# EAGLE design aircopter (EAGLE 9.7.0)
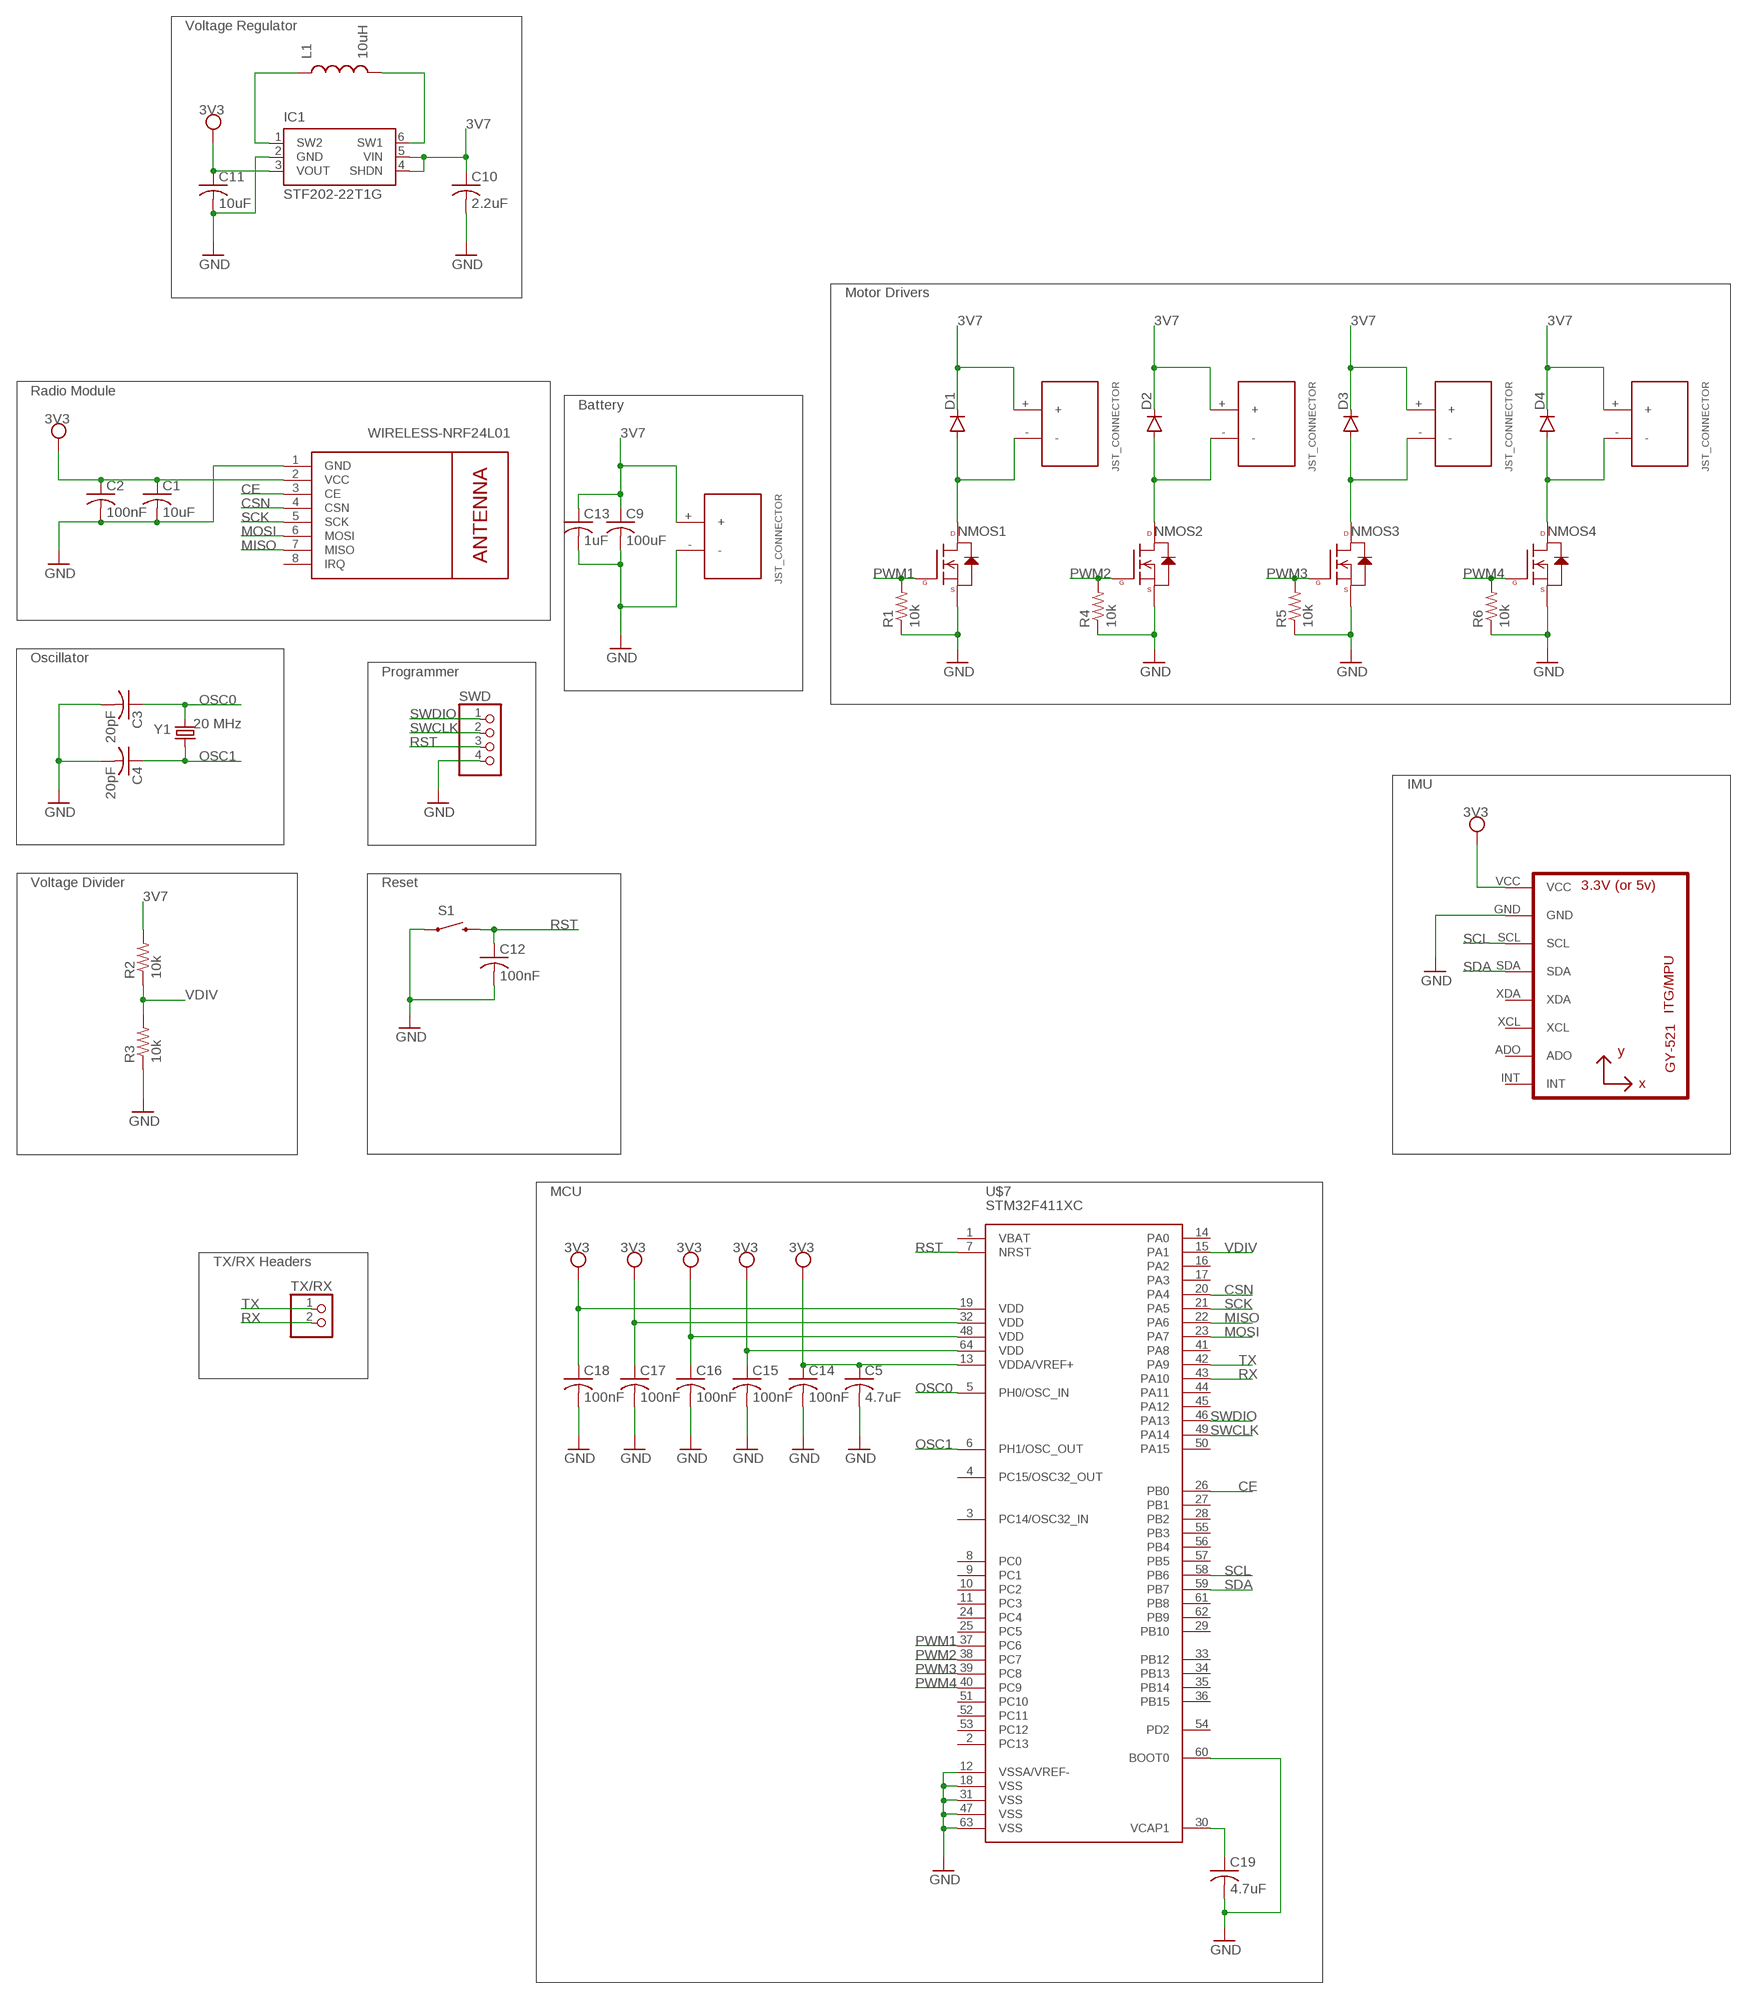
[diagram p0: schematic, sheet 1]

## Parts
C1  10uF  C-USC0603  [C0603]
C2  100nF  C-USC0603  [C0603]
C3  20pF  C-USC0603  [C0603]
C4  20pF  C-USC0603  [C0603]
C5  4.7uF  C-USC0603  [C0603]
C9  100uF  C-USC0603  [C0603]
C10  2.2uF  C-USC0603  [C0603]
C11  10uF  C-USC0603  [C0603]
C12  100nF  C-USC0603  [C0603]
C13  1uF  C-USC0603  [C0603]
C14  100nF  C-USC0603  [C0603]
C15  100nF  C-USC0603  [C0603]
C16  100nF  C-USC0603  [C0603]
C17  100nF  C-USC0603  [C0603]
C18  100nF  C-USC0603  [C0603]
C19  4.7uF  C-USC0603  [C0603]
D1  DIODESMA  [SMA-DIODE]
D2  DIODESMA  [SMA-DIODE]
D3  DIODESMA  [SMA-DIODE]
D4  DIODESMA  [SMA-DIODE]
IC1  STF202-22T1G  [SOT23-6]
L1  10uH  INDUCTOR  [L0603]
M1  WIRELESS-NRF24L01  [WIRELESS-NRF24L01]
NMOS1  N-CHANNEL-MOSFET-BSS138  [SOT23-3]
NMOS2  N-CHANNEL-MOSFET-BSS138  [SOT23-3]
NMOS3  N-CHANNEL-MOSFET-BSS138  [SOT23-3]
NMOS4  N-CHANNEL-MOSFET-BSS138  [SOT23-3]
R1  10k  R-US_R0603  [R0603]
R2  10k  R-US_R0603  [R0603]
R3  10k  R-US_R0603  [R0603]
R4  10k  R-US_R0603  [R0603]
R5  10k  R-US_R0603  [R0603]
R6  10k  R-US_R0603  [R0603]
S1  SWITCH-MOMENTARY-2SMD  [TACTILE-SWITCH-SMD]
SWD  PINHD-1X4  [1X04]
TX/RX  PINHD-1X2  [1X02]
U2  GY-521MPU6050  [GY-521]
U$2  JST_CONNECTOR_FEMALE  [JST_CONNECTOR_FEMALE]
U$3  JST_CONNECTOR_FEMALE  [JST_CONNECTOR_FEMALE]
U$4  JST_CONNECTOR_FEMALE  [JST_CONNECTOR_FEMALE]
U$5  JST_CONNECTOR_FEMALE  [JST_CONNECTOR_FEMALE]
U$6  JST_CONNECTOR_FEMALE  [JST_CONNECTOR_FEMALE]
U$7  STM32F411XC  [LQFP64]
Y1  20 MHz  CRYSTALSMD  [HC49UP]

## Nets
3V3: C1.1 C2.1 C5.1 C11.1 C14.1 C15.1 C16.1 C17.1 C18.1 IC1.3(VOUT) M1.2(VCC) U2.VCC U$7.13(VDDA/VREF+) U$7.19(VDD) U$7.32(VDD) U$7.48(VDD) U$7.64(VDD) ; supply symbol labelled 3V3-CIRCLE
3V7: C9.1 C10.1 C13.1 D1.C D2.C D3.C D4.C IC1.4(SHDN) IC1.5(VIN) R2.2 U$2.+ U$3.+ U$4.+ U$5.+ U$6.+
CE: M1.3(CE) U$7.26(PB0)
CSN: M1.4(CSN) U$7.20(PA4)
GND: C1.2 C2.2 C3.2 C4.2 C5.2 C9.2 C10.2 C11.2 C12.2 C13.2 C14.2 C15.2 C16.2 C17.2 C18.2 C19.2 IC1.2(GND) M1.1(GND) NMOS1.2(S) NMOS2.2(S) NMOS3.2(S) NMOS4.2(S) R1.1 R3.1 R4.1 R5.1 R6.1 S1.1 SWD.4 U2.GND U$6.- U$7.12(VSSA/VREF-) U$7.18(VSS) U$7.31(VSS) U$7.47(VSS) U$7.60(BOOT0) U$7.63(VSS) ; supply symbol labelled SUPPLY1_GND
MISO: M1.7(MISO) U$7.22(PA6)
MOSI: M1.6(MOSI) U$7.23(PA7)
N$1: D1.A NMOS1.3(D) U$2.-
N$2: D2.A NMOS2.3(D) U$3.-
N$3: D3.A NMOS3.3(D) U$4.-
N$4: D4.A NMOS4.3(D) U$5.-
N$5: IC1.1(SW2) L1.1
N$6: IC1.6(SW1) L1.2
N$7: C19.1 U$7.30(VCAP1)
OSC0: C3.1 U$7.5(PH0/OSC_IN) Y1.2
OSC1: C4.1 U$7.6(PH1/OSC_OUT) Y1.1
PWM1: NMOS1.1(G) R1.2 U$7.37(PC6)
PWM2: NMOS2.1(G) R4.2 U$7.38(PC7)
PWM3: NMOS3.1(G) R5.2 U$7.39(PC8)
PWM4: NMOS4.1(G) R6.2 U$7.40(PC9)
RST: C12.1 S1.3 SWD.3 U$7.7(NRST)
RX: TX/RX.2 U$7.43(PA10)
SCK: M1.5(SCK) U$7.21(PA5)
SCL: U2.SCL U$7.58(PB6)
SDA: U2.SDA U$7.59(PB7)
SWCLK: SWD.2 U$7.49(PA14)
SWDIO: SWD.1 U$7.46(PA13)
TX: TX/RX.1 U$7.42(PA9)
VDIV: R2.1 R3.2 U$7.15(PA1)
Unconnected: M1.8(IRQ) U2.ADO U2.INT U2.XCL U2.XDA U$7.1(VBAT) U$7.2(PC13) U$7.3(PC14/OSC32_IN) U$7.4(PC15/OSC32_OUT) U$7.8(PC0) U$7.9(PC1) U$7.10(PC2) U$7.11(PC3) U$7.14(PA0) U$7.16(PA2) U$7.17(PA3) U$7.24(PC4) U$7.25(PC5) U$7.27(PB1) U$7.28(PB2) U$7.29(PB10) U$7.33(PB12) U$7.34(PB13) U$7.35(PB14) U$7.36(PB15) U$7.41(PA8) U$7.44(PA11) U$7.45(PA12) U$7.50(PA15) U$7.51(PC10) U$7.52(PC11) U$7.53(PC12) U$7.54(PD2) U$7.55(PB3) U$7.56(PB4) U$7.57(PB5) U$7.61(PB8) U$7.62(PB9)

## Notes on the sheet
- Voltage Regulator
- Motor Drivers
- Radio Module
- Battery
- Oscillator
- Programmer
- IMU
- Voltage Divider | Reset
- MCU
- TX/RX Headers

## Library data of the parts
C1-C5 C9-C19 = rcl:C-US: CAPACITOR, American symbol; SPICEPREFIX: C
D1-D4 = BeagleBone_Blue_R3:DIODE: Diode These are standard reverse protection diodes and small signal diodes. SMA package can handle up to about 1A. SOD-323 can handle about 200mA. What the SOD-323 package when ordering, there are some mfgs out there that are 5-pin packages.
IC1 = stf202_10:STF202-22T1G: USB Filter with ESD Protection Source: http://www.onsemi.com/pub_link/Collateral/STF202-22T1-D.PDF; MF: ON Semiconductor; MPN: STF202-22T1G; OC_FARNELL: 1651958; OC_NEWARK: 45J2271
L1 = BeagleBone_Blue_R3:INDUCTOR: Inductors Basic Inductor/Choke - 0603 and 1206. Footprints are not proven and vary greatly between part numbers. SRN6045- 33uH, 20% 1.4A
M1 = AP_quad:WIRELESS-NRF24L01: 2.4 GHz Wireless Module based on NRF24L01 chip
NMOS1-NMOS4 = AP_quad:N-CHANNEL-MOSFET: N-Channel MOSFET Mode Field Effect Transistor; DATASHEET: http://www.fairchildsemi.com/ds/BS/BSS138.pdf; DIGIKEY: BSS138TR-ND; ELEMENT14: 2323154; URL: http://au.element14.com/fairchild-semiconductor/bss138/mosfet-n-ch-50v-220ma-sot-23/dp/2323154
R1-R6 = rcl:R-US_: RESISTOR, American symbol; SPICEPREFIX: R
S1 = AP_quad:SWITCH-MOMENTARY-2: Various NO switches- pushbuttons, reed, etc; PROD_ID: SWCH-08247
SWD = pinhead:PINHD-1X4: PIN HEADER
TX/RX = pinhead:PINHD-1X2: PIN HEADER
U2 = Aircopter_quad_lib:GY-521
U$2-U$6 = Aircopter_quad_lib:JST_CONNECTOR_FEMALE
U$7 = Aircopter_quad_lib:STM32F411XC: STM32F411XC
Y1 = Aircopter_quad_lib:CRYSTAL: Crystals Various standard crystals. Proven footprints. Spark Fun Electronics SKU : COM-00534

## Board
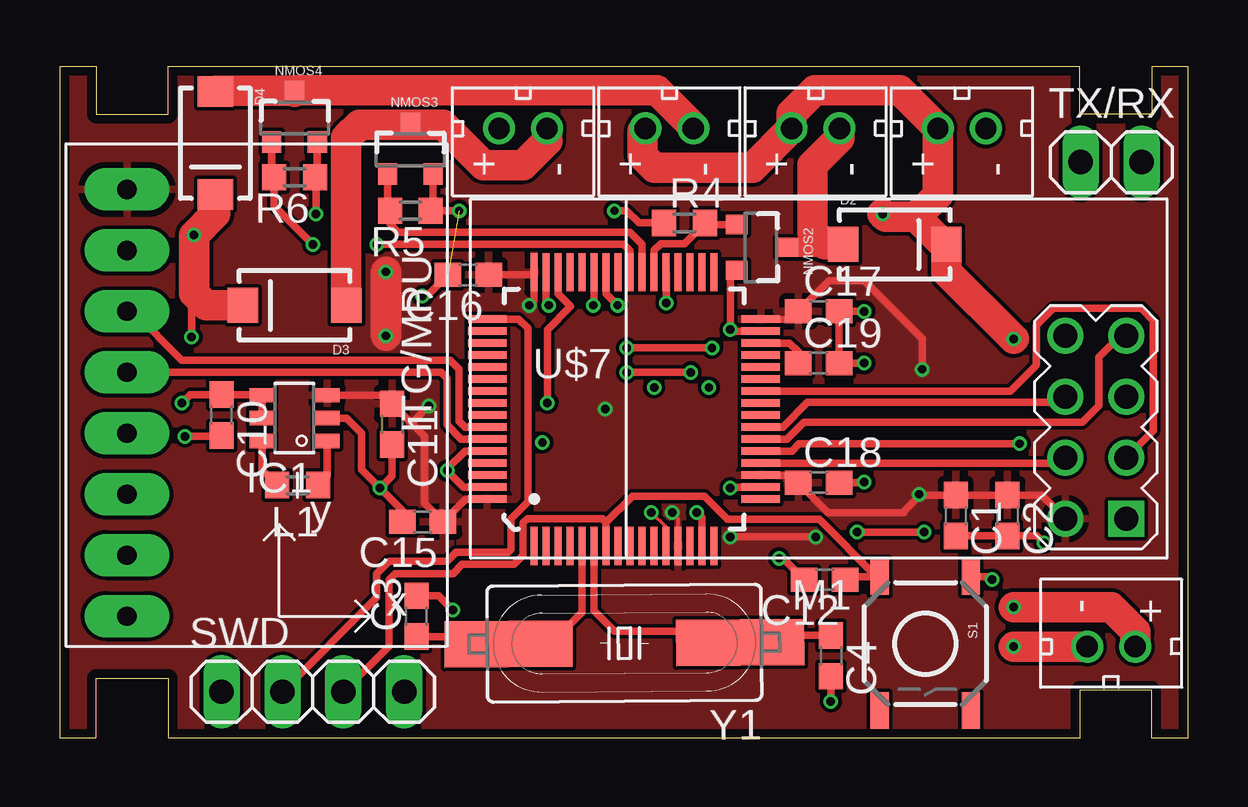
[diagram p1: board, top side]
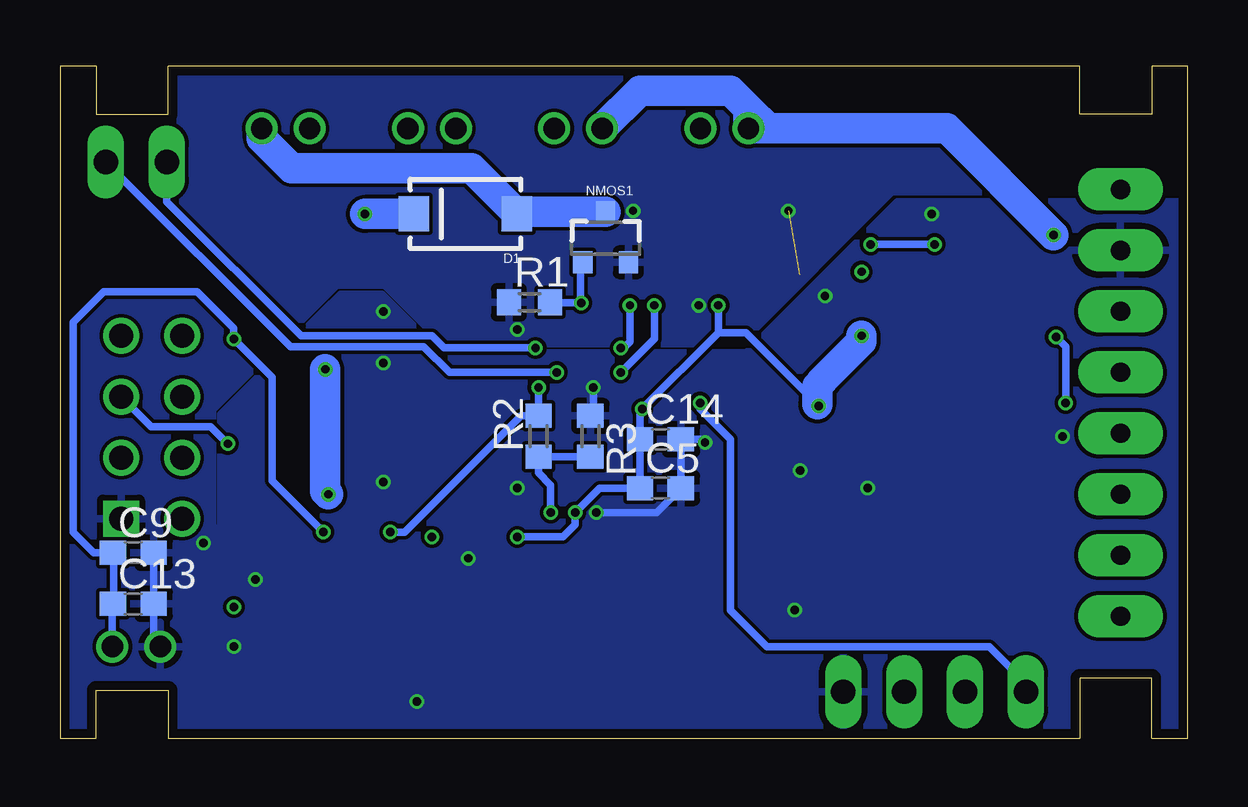
[diagram p2: board, bottom side, seen from below]

Size 47 x 28 mm. Coordinates in mm from the lower left corner, seen from the top.
Outline: 0,0 0,28 1.5,28 1.5,26 4.5,26 4.5,28 42.5,28 42.5,26 45.5,26 45.5,28 47,28 47,0 45.5,0 45.5,2 42.5,2 42.5,0 4.5,0 4.5,2.5 1.5,2.5 1.5,0 0,0
Copper layers (1*16): Top 0.035559375mm / dielectric 1.6mm / Bottom 0.035559375mm
Design rules "oshpark-2layer": minimum track width 6mil, minimum drill 10mil, track to track 6mil, track to pad 6mil, pad to pad 6mil, via to via 6mil, smd to smd 6mil, copper to edge 15mil, drill to drill 6mil, minimum pad ring 5mil, minimum via ring 5mil, stop-mask expansion 2.5mil, vias tented up to drill 0mil, thermal gap 10mil

### Footprints (pad centres in the part's own frame; a part is rotated, then mirrored left to right if it is on the bottom)
C0603 = smd 1.1 x 1: 1 -0.85,0; 2 0.85,0
SMA-DIODE = smd 1.27 x 1.47: A -2.15,0; C 2.15,0
SOT23-6 = smd 0.6 x 1.05: 1 -0.95,-1.35; 2 0,-1.35; 3 0.95,-1.35; 4 0.95,1.35; 5 0,1.35; 6 -0.95,1.35
L0603 = smd 1 x 1.1: 1 -0.85,0; 2 0.85,0
WIRELESS-NRF24L01 = drill 1 square: 1 -12.7,6.35 | drill 1: 2 -10.16,6.35; 3 -12.7,3.81; 4 -10.16,3.81; 5 -12.7,1.27; 6 -10.16,1.27; 7 -12.7,-1.27; 8 -10.16,-1.27
SOT23-3 = smd 0.8 x 0.9: 1 -0.95,-1; 2 0.95,-1; 3 0,1.1
R0603 = smd 1 x 1.1: 1 -0.85,0; 2 0.85,0
TACTILE-SWITCH-SMD = smd 1.524 x 0.762: 1 -2.794,1.905; 2 2.794,1.905; 3 -2.794,-1.905; 4 2.794,-1.905
1X04 = drill 1.016 long: 1 -3.81,0; 2 -1.27,0; 3 1.27,0; 4 3.81,0
1X02 = drill 1.016 long: 1 -1.27,0; 2 1.27,0
GY-521 = drill 0.8 pad 1.778 long: ADO -8.89,-6.35; GND -8.89,6.35; INT -8.89,-8.89; SCL -8.89,3.81; SDA -8.89,1.27; VCC -8.89,8.89; XCL -8.89,-3.81; XDA -8.89,-1.27
JST_CONNECTOR_FEMALE = drill 0.889: + 0,1; - 0,-1
LQFP64 = smd 0.3 x 1.6: 1 -3.75,-5.7; 2 -3.25,-5.7; 3 -2.75,-5.7; 4 -2.25,-5.7; 5 -1.75,-5.7; 6 -1.25,-5.7; 7 -0.75,-5.7; 8 -0.25,-5.7; 9 0.25,-5.7; 10 0.75,-5.7; 11 1.25,-5.7; 12 1.75,-5.7; 13 2.25,-5.7; 14 2.75,-5.7; 15 3.25,-5.7; 16 3.75,-5.7; 33 3.75,5.7; 34 3.25,5.7; 35 2.75,5.7; 36 2.25,5.7; 37 1.75,5.7; 38 1.25,5.7; 39 0.75,5.7; 40 0.25,5.7; 41 -0.25,5.7; 42 -0.75,5.7; 43 -1.25,5.7; 44 -1.75,5.7; 45 -2.25,5.7; 46 -2.75,5.7; 47 -3.25,5.7; 48 -3.75,5.7 | smd 1.6 x 0.3: 17 5.7,-3.75; 18 5.7,-3.25; 19 5.7,-2.75; 20 5.7,-2.25; 21 5.7,-1.75; 22 5.7,-1.25; 23 5.7,-0.75; 24 5.7,-0.25; 25 5.7,0.25; 26 5.7,0.75; 27 5.7,1.25; 28 5.7,1.75; 29 5.7,2.25; 30 5.7,2.75; 31 5.7,3.25; 32 5.7,3.75; 49 -5.7,3.75; 50 -5.7,3.25; 51 -5.7,2.75; 52 -5.7,2.25; 53 -5.7,1.75; 54 -5.7,1.25; 55 -5.7,0.75; 56 -5.7,0.25; 57 -5.7,-0.25; 58 -5.7,-0.75; 59 -5.7,-1.25; 60 -5.7,-1.75; 61 -5.7,-2.25; 62 -5.7,-2.75; 63 -5.7,-3.25; 64 -5.7,-3.75
HC49UP = smd 5.334 x 1.93: 1 -4.826,0; 2 4.826,0

### Placement (x,y rotation side)
C1  37.34,9.27 270 top
C2  39.5,9.27 270 top
C3  14.86,5.08 90 top
C4  32.13,3.43 270 top
C5  21.97,10.41 0 bottom
C9  43.94,7.72 0 bottom
C10  6.73,13.46 270 top
C11  13.84,13.08 270 top
C12  31.88,6.6 180 top
C13  43.94,5.59 0 bottom
C14  21.97,12.45 0 bottom
C15  15.11,9.02 180 top
C16  17.02,19.3 180 top
C17  31.62,17.78 0 top
C18  31.62,10.64 0 top
C19  31.62,15.62 0 top
D1  30.1,21.84 180 bottom
D2  34.8,20.57 0 top
D3  9.78,18.03 180 top
D4  6.48,24.79 270 top
IC1  9.78,13.34 90 top
L1  9.91,10.54 180 top
M1  31.75,15.49 180 top
NMOS1  24.26,20.83 0 bottom
NMOS2  29.21,20.45 270 top
NMOS3  14.61,24.51 0 top
NMOS4  9.78,25.83 0 top
R1  27.43,18.16 0 bottom
R2  27.05,12.57 90 bottom
R3  24.89,12.57 270 bottom
R4  26.04,21.46 0 top
R5  14.61,21.97 180 top
R6  9.78,23.37 180 top
S1  36.07,3.94 270 top
SWD  10.54,1.93 0 top
TX/RX  43.81,24 0 top
U2  11.68,13.97 0 top
U$2  37.59,25.4 90 top
U$3  31.5,25.4 90 top
U$4  19.3,25.4 90 top
U$5  25.4,25.4 90 top
U$6  43.81,3.81 270 top
U$7  23.51,13.71 0 top
Y1  23.52,3.95 180.4 top

### Tracks (layer width: path | path; a pad name or v marks a point on that pad's centre or on a via)
3V3  (via drill 0.35)
  Top 0.152: U$7.13 25.76,9.16 v25.53,9.4 | 30.69,17.7 C17.1 | C18.1 30.77,10.69 30.51,10.96
  Top 0.305: U$7.64 16.91,9.96 C15.1 15.2,9.78 15.2,12.57 14.59,13.19 | C16.1 19.66,19.3 U$7.48 19.76,18.24 v19.56,18.03 | IC1.3 13.49,14.29 C11.1 14.59,13.19 | 14.59,13.19 14.71,13.19 v15.37,13.84 | v27.94,8.38 v31.5,8.38 | U$7.32 30.45,17.46 30.69,17.7 | C17.1 32.04,19.05 33.53,19.05 35.94,16.64 v35.94,15.37 | M1.2 40.93,10.12 C2.1 C1.1 35.85,10.12 | 35.85,10.12 v35.81,10.16 | U$7.19 30.51,10.96 | 35.85,10.12 35.18,9.45 35.18,9.4 32.02,9.4 C18.1
  Top 1.27: v13.59,19.43 v13.59,16.76
  Bottom 0.305: v19.56,18.03 19.56,16.89 | 19.56,16.89 v22.73,13.72 22.82,13.63 C14.1 C5.1 24.51,10.41 v25.53,9.4 25.53,8.89 26.04,8.38 v27.94,8.38 | v15.37,13.84 15.43,13.91 18.41,16.89 19.56,16.89
  Bottom 1.27: v13.59,16.76 13.59,16.53 15.24,14.88 15.22,14.88 15.43,14.67 15.43,13.91 | v35.94,15.37 35.94,10.29 v35.81,10.16
  pour Top: -0.36,-0.58 47.6,-0.58 47.62,-0.61 47.62,28.42 47.65,28.45 -0.38,28.32
3V7  (via drill 0.35)
  Top 0.305: IC1.5 IC1.4 8.4,14.31 C10.1 5.42,14.31 v5.08,13.97 | 5.59,18.54 5.49,18.44 v5.49,16.71 | v33.22,8.59 v36.02,8.59
  Top 1.27: D4.C 6.48,21.84 v5.59,20.95 5.59,18.54 6.1,18.03 D3.C | U$6.+ 44.81,4.43 44.83,4.45 43.81,5.46 v39.75,5.46 | 35.69,21.72 36.83,20.57 D2.C 36.95,19.44 v39.75,16.64 | 35.69,21.72 34.42,21.72 v34.29,21.84 | 35.69,21.72 36.59,22.62 U$2.+ 35.01,26.98 31.47,26.98 30.5,26.01 U$3.+ 28.85,23.76 24.79,23.76 24.28,24.27 24.28,25.28 U$5.+
  Bottom 0.305: U$6.+ 44.81,5.57 C13.1 44.77,5.61 44.77,7.7 C9.1 45.59,7.72 46.46,8.59 46.46,17.32 45.19,18.59 41.27,18.59 39.75,17.07 v39.75,16.64 38.15,15.04 38.15,10.72 v36.02,8.59 | v27.05,14.61 R2.2 27.79,13.42 32.62,8.59 v33.22,8.59 | v5.08,13.97 5.08,16.31 v5.49,16.71
  Bottom 1.27: D1.C v34.29,21.84 | U$5.+ 22.82,26.98 19.05,26.98 18.3,26.23 | 18.3,26.23 U$4.+ 17.48,25.4 | 17.48,25.4 10.03,25.4 v5.59,20.95 | 17.48,25.4 18.3,26.23
CE
  Top 0.305: M1.3 45.58,12.81 45.58,17.4 45.07,17.91 41.4,17.91 40.69,17.2 40.69,15.54 39.61,14.46 U$7.26
CSN
  Top 0.305: M1.4 41.69,11.46 U$7.20
GND  (via drill 0.35)  (1 unrouted)
  Top 0.152: 32.73,10.39 C18.2 | C19.2 | 17.83,11.94 U$7.60 | 28,16.96 v27.94,17.02 | 27.99,10.46 v27.94,10.41 | U$7.12 25.26,8.8 24.66,9.4 v24.64,9.4
  Top 0.305: v16.38,5.33 15.79,5.93 C3.2 | v32.13,1.52 C4.2 | v38.86,6.6 38.73,6.73 S1.1 | C1.2 C2.2 40.73,8.42 v41.02,8.13 | v33.53,10.67 33.5,10.64 C18.2 | U$7.18 27.99,10.46 | C12.2 30.14,7.49 v29.97,7.49 | v33.53,17.78 C17.2 C19.2 v33.53,15.62 | 15.62,23.45 NMOS3.2 15.55,22.07 R5.1 v16.64,21.97 | 10.79,24.77 NMOS4.2 10.73,23.47 R6.1 10.67,23.33 v10.67,21.84 | C16.2 15.28,18.41 v15.11,18.41 | U$7.47 20.26,18.14 v20.37,18.03 | v23.11,21.97 23.62,21.97 24.13,21.46 R4.1 | v27.94,17.02 27.94,19.23 NMOS2.2 | IC1.2 11.94,13.34 12.57,12.7 12.57,11.18 v13.34,10.41 | C10.2 6.69,12.57 v5.21,12.57 | C11.2 13.84,10.92 v13.34,10.41 | v13.34,10.41 14.26,9.49 C15.2 | U$7.60 16.88,11.96 16.14,11.22 v16.14,11.14 16.82,10.46 U$7.63 | U$7.31 28,16.96
  Top 1.27: U$6.- v39.75,3.81
  Bottom 0.305: C9.2 C13.2 43.09,4.09 U$6.- | v24.64,9.4 22.14,9.4 C5.2 C14.2 20.24,12.45 v20.11,12.32 | R3.1 24.77,13.55 v24.77,14.61
  pour Bottom: -0.43,22.78 -0.46,22.76 12.32,22.76 18.64,16.43 31.04,16.43 33.48,18.87 35.46,18.87 40.64,13.69 40.64,-1.04 40.61,-1.07 47.65,-1.07 47.68,-1.04 47.68,28.5 -0.43,28.5
  pour Bottom: 12.09,22.35 18.39,16.05 18.82,16.05 31.14,16.05 33.58,18.49 33.76,18.49 35.31,18.49 36.04,17.75 40.31,13.49 40.31,9.02 40.31,8.74 47.62,8.74 47.65,8.76 47.65,-0.61 -0.36,-0.61 -0.38,-0.64 -0.38,22.35
MISO
  Top 0.305: U$7.22 30.3,12.46 31,13.16 42.62,13.16 43.31,13.84 43.31,15.88 44.2,16.76 M1.7
MOSI
  Top 0.305: U$7.23 30.13,12.96 31.16,13.99 41.17,13.99 41.4,14.22 M1.6
N$1
  Bottom 1.27: NMOS1.3 27.86,21.93 D1.A 29.85,23.75 37.34,23.75 38.59,25 U$2.-
N$2
  Top 0.813: NMOS2.3 31.75,20.45 31.88,20.57
  Top 1.27: D2.A 31.88,20.57 31.37,21.08 31.37,23.88 32.5,25 U$3.-
N$3
  Top 0.305: 14.66,25.56 NMOS3.3 14.55,25.56
  Top 1.27: 14.66,25.56 15.97,25.56 17.65,23.88 19.3,23.88 20.32,24.89 20.3,24.91 U$4.- | 14.55,25.56 12.48,25.56 11.93,25.01 11.93,19.3 D3.A
N$4
  Top 1.27: U$5.- 26.4,25.47 24.89,26.98 9.78,26.98 NMOS4.3 9.74,26.97 6.5,26.97 D4.A
N$5
  Top 0.305: IC1.1 11.13,10.91 L1.1
N$6
  Top 0.305: IC1.6 8.43,11.17 L1.2
N$7
  Top 0.305: U$7.30 30.4,16.46 30.77,16.09 C19.1
OSC0
  Top 0.305: U$7.5 21.76,5.25 20.43,3.92 Y1.2 18.38,4.23 16.1,4.23 C3.1
OSC1
  Top 0.305: U$7.6 22.26,5.3 23.11,4.45 26.52,4.45 26.64,4.57 27.76,4.57 Y1.1 28.64,4.28 C4.1
PWM1  (via drill 0.35)
  Top 0.305: U$7.37 25.27,19.4 v25.27,18.14
  Bottom 0.305: R1.2 26.56,18.14 v25.27,18.14 25.3,18.16 25.3,19.74 NMOS1.1
PWM2
  Top 0.305: NMOS2.1 26.95,21.4 R4.2 26.02,20.6 25.04,20.6 24.76,20.32 U$7.38
PWM3
  Top 0.305: U$7.39 24.26,20.57 23.75,21.08 14.1,21.08 13.76,21.42 R5.2 13.65,22.07 NMOS3.1
PWM4  (via drill 0.35)
  Top 0.305: U$7.40 23.76,20.31 23.5,20.57 v13.21,20.57 | NMOS4.1 8.83,23.47 R6.2 8.93,22.19 v10.54,20.57
  Bottom 0.305: v10.54,20.57 v13.21,20.57
RST
  Top 0.305: SWD.3 13.72,3.83 13.72,6.6 13.97,6.86 16.38,6.86 16.76,7.24 18.92,7.24 19.3,7.62 19.3,8.97 19.48,9.14 22.61,9.14 22.76,8.99 | U$7.7 22.76,8.99 | 22.76,8.99 23.86,10.08 26.86,10.08 27.82,9.12 31.65,9.12 34.04,6.73 S1.3 32.85,6.73 C12.1
RX  (via drill 0.35)
  Top 0.305: U$7.43 22.26,18.07 v22.23,18.03 | v23.62,15.24 v26.29,15.24
  Bottom 0.305: v26.29,15.24 30.77,15.24 31.84,16.31 37.39,16.31 TX/RX.2 | v22.23,18.03 22.23,16.64 v23.62,15.24
SCK  (via drill 0.35)
  Top 0.305: U$7.21 30.51,11.96 30.81,12.27 39.44,12.27 v40.01,12.27
  Bottom 0.305: v40.01,12.27 40.72,12.98 43.2,12.98 M1.5
SCL
  Top 0.305: U2.SCL 3.05,17.78 5.08,15.75 16.26,15.75 16.64,15.37 16.64,13.21 16.89,12.96 U$7.58
SDA
  Top 0.305: U$7.59 16.73,12.46 16.13,13.06 16.13,14.99 15.88,15.24 U2.SDA
SWCLK
  Top 0.305: SWD.2 13.21,5.87 13.21,6.86 13.72,7.37 16.13,7.37 16.51,7.75 18.67,7.75 18.8,7.87 18.8,9.14 19.51,9.86 19.51,17.07 19.12,17.46 U$7.49
SWDIO  (via drill 0.35)
  Top 0.305: U$7.46 20.76,18.51 21.29,17.98 20.32,17.02 v20.32,13.97
  Bottom 0.305: SWD.1 6.73,2.29 8.26,3.81 17.53,3.81 19.05,5.33 19.05,12.45 20.32,13.72 v20.32,13.97
TX  (via drill 0.35)
  Top 0.305: U$7.42 22.76,18.51 v23.24,18.03 | v27.18,16.26 v23.62,16.26
  Bottom 0.305: TX/RX.1 42.55,22.35 36.96,16.76 31.5,16.76 30.99,16.26 v27.18,16.26 | v23.24,18.03 23.24,16.51 23.5,16.26 v23.62,16.26
VDIV  (via drill 0.35)
  Top 0.305: U$7.15 26.76,9.18 v26.54,9.4
  Bottom 0.305: v26.54,9.4 26.54,10.54 27.05,11.05 R2.1 R3.2